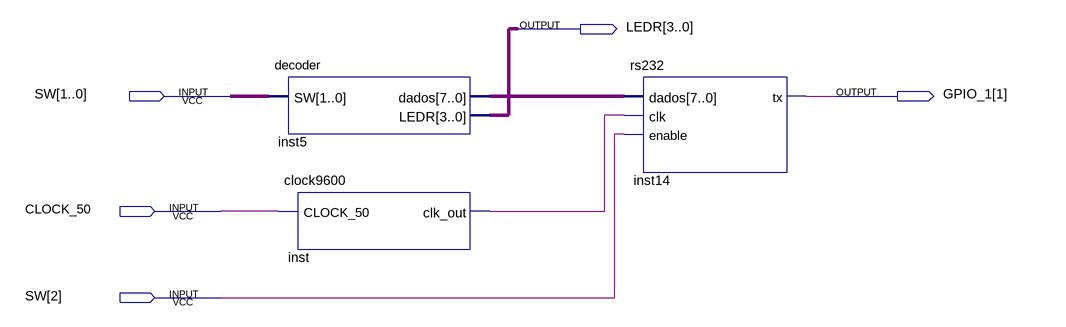
[diagram p0: schematic sheet]
// Quartus schematic serial_arduino.bdf as structural Verilog: 3 symbols, 5 pins
module serial_arduino (
  input  [2:0] SW,
  input  CLOCK_50,
  output [3:0] LEDR,
  output [1:1] GPIO_1
);

  wire inst_clk_out;
  wire [7:0] inst5_dados;

  decoder inst5 (.SW(SW[1:0]), .dados(inst5_dados), .LEDR(LEDR));
  clock9600 inst (.CLOCK_50(CLOCK_50), .clk_out(inst_clk_out));
  rs232 inst14 (.dados(inst5_dados), .clk(inst_clk_out), .enable(SW[2]), .tx(GPIO_1[1]));
endmodule
